# Altium schematic sheet SOM_JB3.SchDoc: SoM TE0720 JB3
size 420 x 297 mm; Author: P. Zdunek; DrawnBy: P. Zdunek; Organization: Altium Limited; Address1: L3, 12a Rodborough Rd; Address2: Frenchs Forest; Address3: NSW; Address4: Australia 2086; DocumentNumber: 5; SheetNumber: 5; SheetTotal: 37; ModifiedBy: -; CheckedDate: -; Title2: Fast Stabilizer; DivGrp: WUT ISE; Designer: G.Kasprowicz
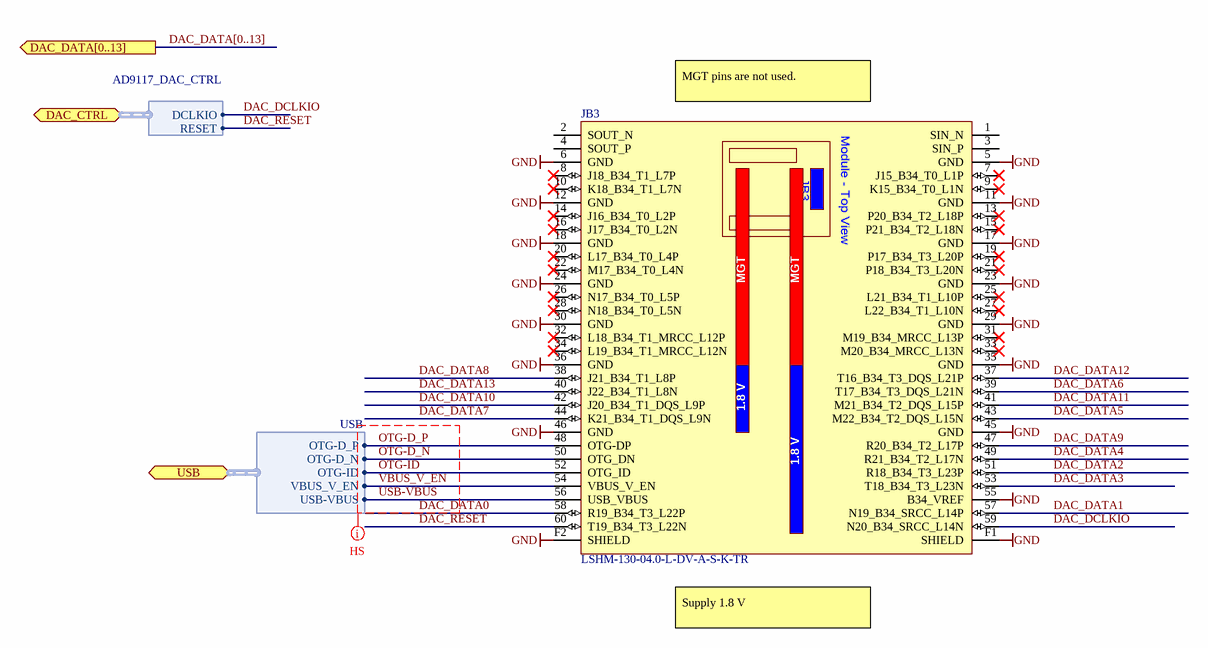
[diagram p0: SOM_JB3.SchDoc]

## Parts
JB3  LSHM-130-04.0-L-DV-A-S-K-TR  [LSHM-130-04.0-x-DV-A-S-K-TR]

## Ports
DAC_CTRL (bidir, harness AD9117_DAC_CTRL), DAC_DATA[0..13] (out), USB (bidir, harness USB)

## Harnesses
USB: USB-VBUS, VBUS_V_EN, OTG-D_P, OTG-D_N, OTG-ID
AD9117_DAC_CTRL: DCLKIO, RESET

## Nets
GND: JB3.5(GND) JB3.6(GND) JB3.11(GND) JB3.12(GND) JB3.17(GND) JB3.18(GND) JB3.23(GND) JB3.24(GND) JB3.29(GND) JB3.30(GND) JB3.35(GND) JB3.36(GND) JB3.45(GND) JB3.46(GND) JB3.55(B34_VREF) JB3.F1(SHIELD) JB3.F2(SHIELD)
DAC_DATA0: JB3.58(R19_B34_T3_L22P)
DAC_DATA1: JB3.57(N19_B34_SRCC_L14P)
DAC_DATA2: JB3.51(R18_B34_T3_L23P)
DAC_DATA3: JB3.53(T18_B34_T3_L23N)
DAC_DATA4: JB3.49(R21_B34_T2_L17N)
DAC_DATA5: JB3.43(M22_B34_T2_DQS_L15N)
DAC_DATA6: JB3.39(T17_B34_T3_DQS_L21N)
DAC_DATA7: JB3.44(K21_B34_T1_DQS_L9N)
DAC_DATA8: JB3.38(J21_B34_T1_L8P)
DAC_DATA9: JB3.47(R20_B34_T2_L17P)
DAC_DATA10: JB3.42(J20_B34_T1_DQS_L9P)
DAC_DATA11: JB3.41(M21_B34_T2_DQS_L15P)
DAC_DATA12: JB3.37(T16_B34_T3_DQS_L21P)
DAC_DATA13: JB3.40(J22_B34_T1_L8N)
DAC_DCLKIO: JB3.59(N20_B34_SRCC_L14N) ; port DAC_CTRL.DCLKIO
DAC_RESET: JB3.60(T19_B34_T3_L22N) ; port DAC_CTRL.RESET
OTG-D_N: JB3.50(OTG_DN) ; port USB.OTG-D_N
OTG-D_P: JB3.48(OTG-DP) ; port USB.OTG-D_P
OTG-ID: JB3.52(OTG_ID) ; port USB.OTG-ID
USB-VBUS: JB3.56(USB_VBUS) ; port USB.USB-VBUS
VBUS_V_EN: JB3.54(VBUS_V_EN) ; port USB.VBUS_V_EN

Not connected (* = marked no-connect by the designer): JB3 1(SIN_N) 2(SOUT_N) 3(SIN_P) 4(SOUT_P) 7(J15_B34_T0_L1P)* 8(J18_B34_T1_L7P)* 9(K15_B34_T0_L1N)* 10(K18_B34_T1_L7N)* 13(P20_B34_T2_L18P)* 14(J16_B34_T0_L2P)* 15(P21_B34_T2_L18N)* 16(J17_B34_T0_L2N)* 19(P17_B34_T3_L20P)* 20(L17_B34_T0_L4P)* 21(P18_B34_T3_L20N)* 22(M17_B34_T0_L4N)* 25(L21_B34_T1_L10P)* 26(N17_B34_T0_L5P)* 27(L22_B34_T1_L10N)* 28(N18_B34_T0_L5N)* 31(M19_B34_MRCC_L13P)* 32(L18_B34_T1_MRCC_L12P)* 33(M20_B34_MRCC_L13N)* 34(L19_B34_T1_MRCC_L12N)*

## Buses and harness runs
bus DAC_DATA[0..13] = port DAC_DATA[0..13]

## Layout directives
net class HIGH_SPEED: DAC_DATA0, OTG-D_N, OTG-D_P, OTG-ID, USB-VBUS, VBUS_V_EN

## Notes on the sheet
- (near JB3) MGT pins are not used.
- (near JB3) MGT
- (near JB3) 1.8 V
- (near JB3) Supply 1.8 V
- Project/Equipment
- Document
- Designer
- Drawn by
- Check.by
- Copyright WUT ISE 2020.
  This documentation describes Open Hardware and is licensed under the CERN OHL v.1.2. You may redistribute and modify this documentation under the terms of the CERN OHL v.1.2. (http://ohwr.org/CERNOHL). This documentation is distributed WITHOUT ANY EXPRESS OR IMPLIED WARRANTY, INCLUDING OF MERCHANTABILITY, SATISFACTORY QUALITY AND FITNESS FOR A PARTICULAR PURPOSE. Please see the CERN OHL v.1.2 for applicable conditions.
- Contact
- File
- Last Mod.
- Print Date
- Sheet
- Size
- A3
- of
- Rev
- (in symbol 25287) Module - Top View

## Library data of the parts
JB3 = 25287: Samtec Razor Beam REF-189017-02, LF-04.0, 60 Pins, für alle 4x5 SoMs; Mixed: SMT; Trenz-Stock: Yes; Trenz-Article-Number: 24903; AN: 25287; Part Number: LSHM-130-04.0-L-DV-A-S-K-TR